# Altium project solinoid_driver.PrjPcb
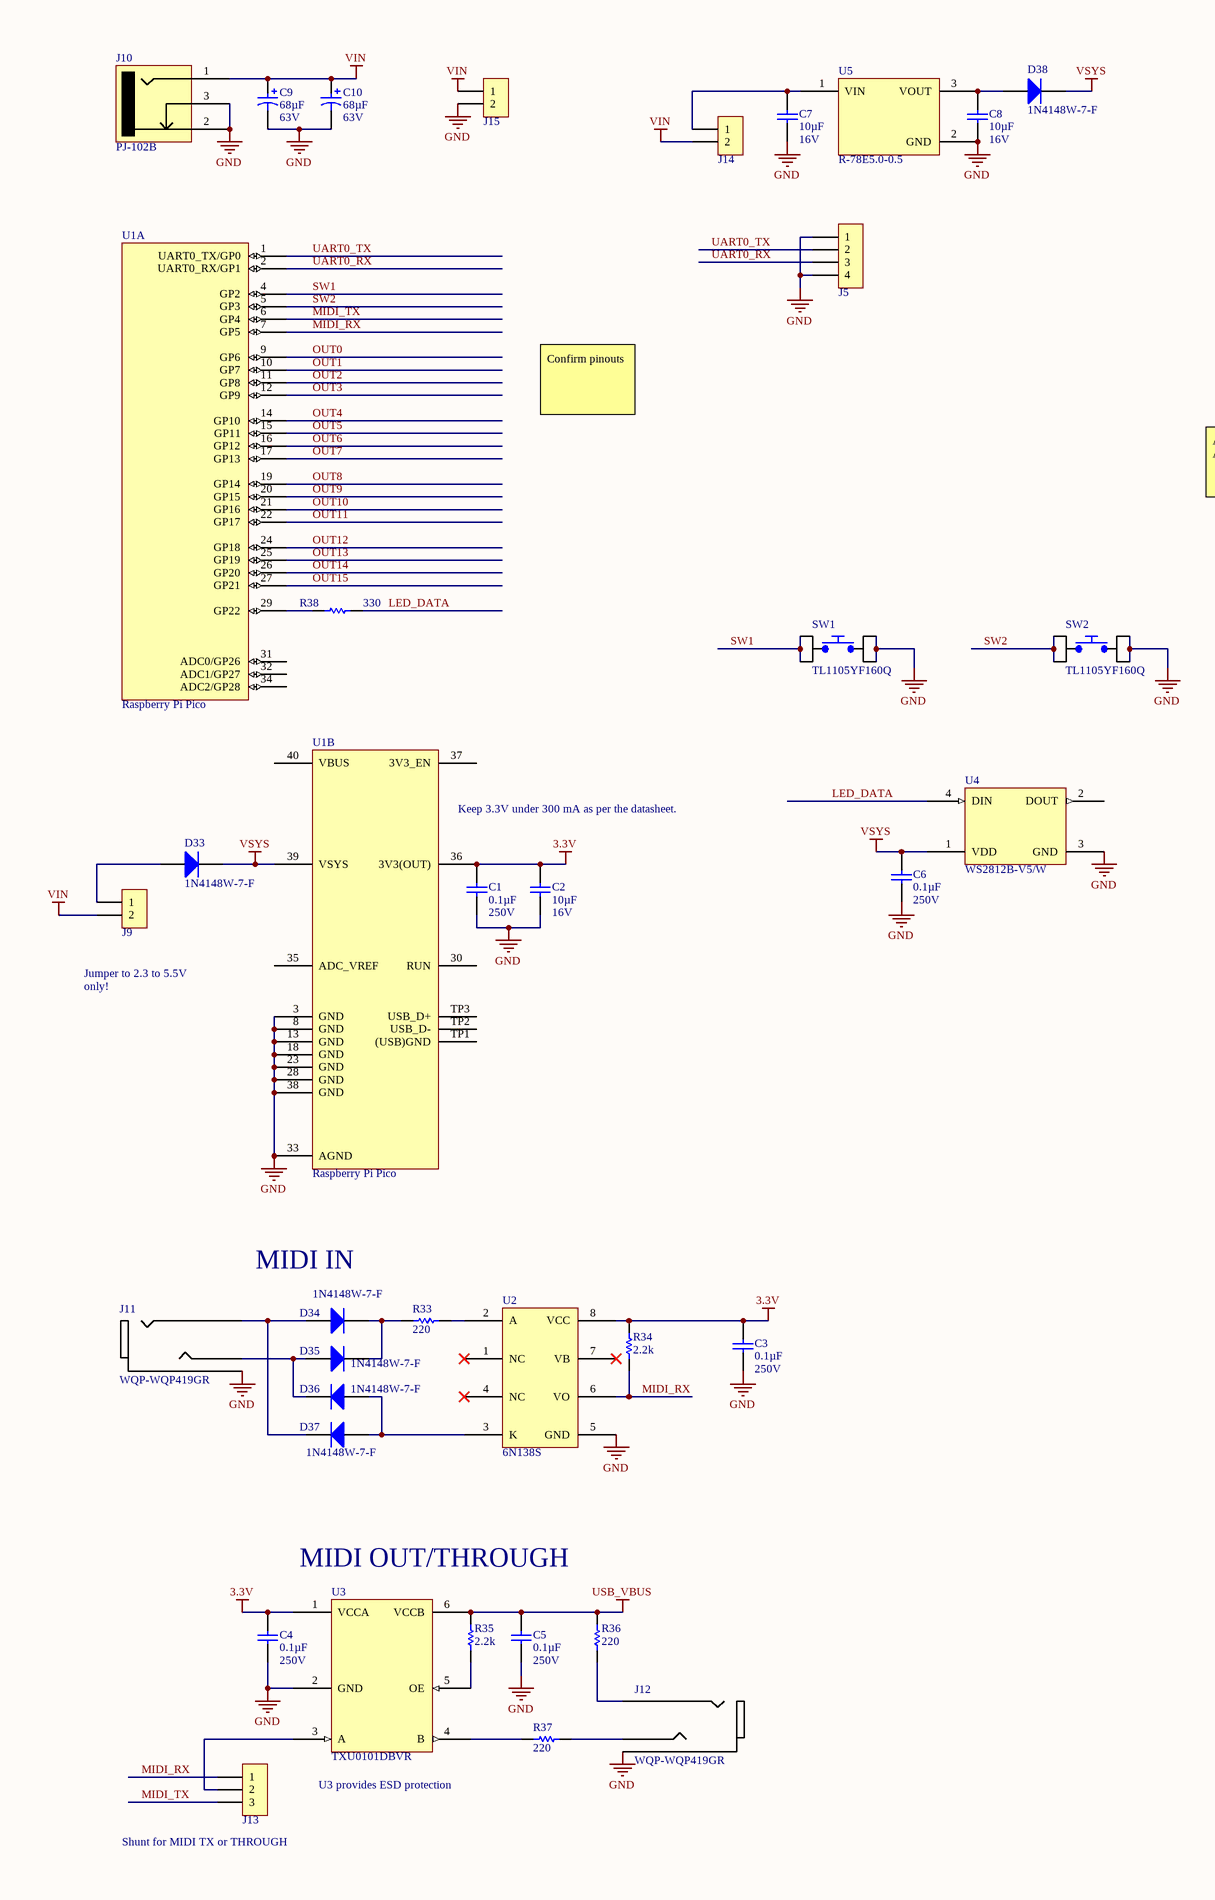
[diagram p0: solinoid_driver.SchDoc, left]
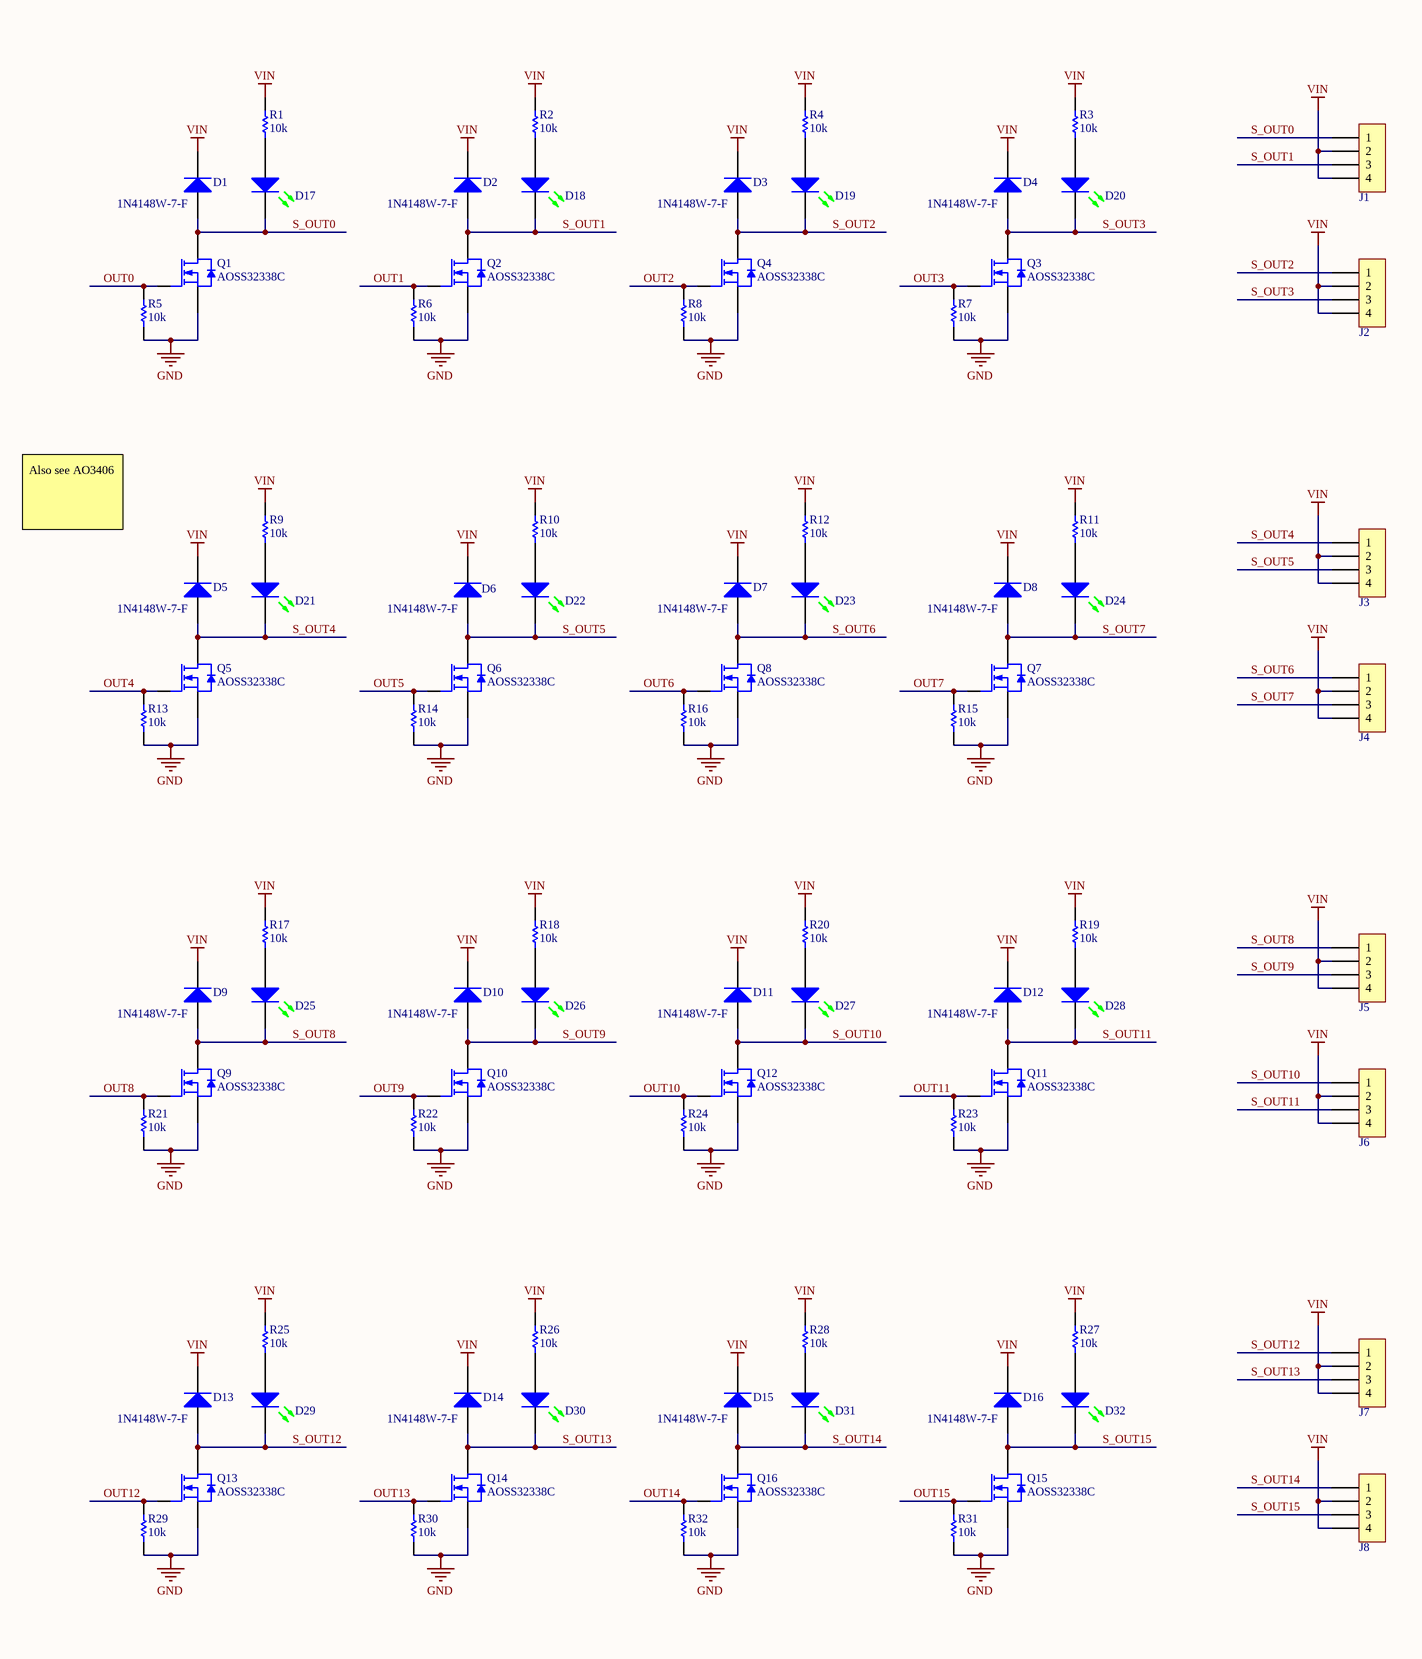
[diagram p1: solinoid_driver.SchDoc, right]
HardRev: A; LeadEngineer: JCF; Codename: solinoid_driver; BOMRev: A
1 sheet, 125 parts. Net scope: global (net labels, ports and power ports of the same name join across sheets).
Board file: solinoid_driver.PcbDoc

## Sheet solinoid_driver.SchDoc
size C; SheetNumber: 1; SheetTotal: 1

### Parts
(Parts that share a designator on the sheet are numbered #1, #2 ... from top to bottom, then left to right.)
C1  0.1µF  Voltage: 250V  [Chip0805]
C2  10µF  Voltage: 16V  [Chip0805]
C3  0.1µF  Voltage: 250V  [Chip0805]
C4  0.1µF  Voltage: 250V  [Chip0805]
C5  0.1µF  Voltage: 250V  [Chip0805]
C6  0.1µF  Voltage: 250V  [Chip0805]
C7  10µF  Voltage: 16V  [Chip0805]
C8  10µF  Voltage: 16V  [Chip0805]
C9  68µF  Voltage Rating: 63V  [CAP_CAN_TH_3p5mmLS8]
C10  68µF  Voltage Rating: 63V  [CAP_CAN_TH_3p5mmLS8]
D1  1N4148W-7-F  [SOD-123]
D2  1N4148W-7-F  [SOD-123]
D3  1N4148W-7-F  [SOD-123]
D4  1N4148W-7-F  [SOD-123]
D5  1N4148W-7-F  [SOD-123]
D6  1N4148W-7-F  [SOD-123]
D7  1N4148W-7-F  [SOD-123]
D8  1N4148W-7-F  [SOD-123]
D9  1N4148W-7-F  [SOD-123]
D10  1N4148W-7-F  [SOD-123]
D11  1N4148W-7-F  [SOD-123]
D12  1N4148W-7-F  [SOD-123]
D13  1N4148W-7-F  [SOD-123]
D14  1N4148W-7-F  [SOD-123]
D15  1N4148W-7-F  [SOD-123]
D16  1N4148W-7-F  [SOD-123]
D17  GREEN  [LED0603]  (value not drawn)
D18  GREEN  [LED0603]  (value not drawn)
D19  GREEN  [LED0603]  (value not drawn)
D20  GREEN  [LED0603]  (value not drawn)
D21  GREEN  [LED0603]  (value not drawn)
D22  GREEN  [LED0603]  (value not drawn)
D23  GREEN  [LED0603]  (value not drawn)
D24  GREEN  [LED0603]  (value not drawn)
D25  GREEN  [LED0603]  (value not drawn)
D26  GREEN  [LED0603]  (value not drawn)
D27  GREEN  [LED0603]  (value not drawn)
D28  GREEN  [LED0603]  (value not drawn)
D29  GREEN  [LED0603]  (value not drawn)
D30  GREEN  [LED0603]  (value not drawn)
D31  GREEN  [LED0603]  (value not drawn)
D32  GREEN  [LED0603]  (value not drawn)
D33  1N4148W-7-F  [SOD-123]
D34  1N4148W-7-F  [SOD-123]
D35  1N4148W-7-F  [SOD-123]
D36  1N4148W-7-F  [SOD-123]
D37  1N4148W-7-F  [SOD-123]
D38  1N4148W-7-F  [SOD-123]
J1  691210910004  [WURTH_691210910004]  (value not drawn)
J2  691210910004  [WURTH_691210910004]  (value not drawn)
J3  691210910004  [WURTH_691210910004]  (value not drawn)
J4  691210910004  [WURTH_691210910004]  (value not drawn)
J5#1  0533980471  [Molex_0533980471]  (value not drawn)
J5#2  691210910004  [WURTH_691210910004]  (value not drawn)
J6  691210910004  [WURTH_691210910004]  (value not drawn)
J7  691210910004  [WURTH_691210910004]  (value not drawn)
J8  691210910004  [WURTH_691210910004]  (value not drawn)
J9  3-644456-2  [TE_3-644456-2]  (value not drawn)
J10  PJ-102B  [CUI_PJ-102B]
J11  WQP-WQP419GR  [PJ366ST]
J12  WQP-WQP419GR  [PJ366ST]
J13  3-644456-3  [TE_3-644456-3]  (value not drawn)
J14  3-644456-2  [TE_3-644456-2]  (value not drawn)
J15  691210910002  [WURTH_691210910002]  (value not drawn)
Q1  AOSS32338C  [SOT23-3N]
Q2  AOSS32338C  [SOT23-3N]
Q3  AOSS32338C  [SOT23-3N]
Q4  AOSS32338C  [SOT23-3N]
Q5  AOSS32338C  [SOT23-3N]
Q6  AOSS32338C  [SOT23-3N]
Q7  AOSS32338C  [SOT23-3N]
Q8  AOSS32338C  [SOT23-3N]
Q9  AOSS32338C  [SOT23-3N]
Q10  AOSS32338C  [SOT23-3N]
Q11  AOSS32338C  [SOT23-3N]
Q12  AOSS32338C  [SOT23-3N]
Q13  AOSS32338C  [SOT23-3N]
Q14  AOSS32338C  [SOT23-3N]
Q15  AOSS32338C  [SOT23-3N]
Q16  AOSS32338C  [SOT23-3N]
R1  10k  [Chip0805]
R2  10k  [Chip0805]
R3  10k  [Chip0805]
R4  10k  [Chip0805]
R5  10k  [Chip0805]
R6  10k  [Chip0805]
R7  10k  [Chip0805]
R8  10k  [Chip0805]
R9  10k  [Chip0805]
R10  10k  [Chip0805]
R11  10k  [Chip0805]
R12  10k  [Chip0805]
R13  10k  [Chip0805]
R14  10k  [Chip0805]
R15  10k  [Chip0805]
R16  10k  [Chip0805]
R17  10k  [Chip0805]
R18  10k  [Chip0805]
R19  10k  [Chip0805]
R20  10k  [Chip0805]
R21  10k  [Chip0805]
R22  10k  [Chip0805]
R23  10k  [Chip0805]
R24  10k  [Chip0805]
R25  10k  [Chip0805]
R26  10k  [Chip0805]
R27  10k  [Chip0805]
R28  10k  [Chip0805]
R29  10k  [Chip0805]
R30  10k  [Chip0805]
R31  10k  [Chip0805]
R32  10k  [Chip0805]
R33  220  [Chip0805]
R34  2.2k  [Chip0805]
R35  2.2k  [Chip0805]
R36  220  [Chip0805]
R37  220  [Chip0805]
R38  330  [Chip0805]
SW1  TL1105YF160Q  [E-Switch_TL1105YF]
SW2  TL1105YF160Q  [E-Switch_TL1105YF]
U1  Raspberry Pi Pico  [RASPBERRY_PI_PICO]  (parts A,B of 2)
U2  6N138S  [6N13XS]
U3  TXU0101DBVR  [SOT-23-6N]
U4  WS2812B-V5/W  [WS2812B]
U5  R-78E5.0-0.5  [3-SIP_Module]

### Nets
3.3V: C1.2 C2.2 C3.2 C4.2 R34.2 U1.36(3V3(OUT)) U2.8(VCC) U3.1(VCCA)
GND: C1.1 C2.1 C3.1 C4.1 C5.1 C6.1 C7.1 C8.1 C9.2 C10.2 J5#1.1 J5#1.4 J10.2 J10.3 J11.1 J12.1 J15.2 Q1.2(S) Q2.2(S) Q3.2(S) Q4.2(S) Q5.2(S) Q6.2(S) Q7.2(S) Q8.2(S) Q9.2(S) Q10.2(S) Q11.2(S) Q12.2(S) Q13.2(S) Q14.2(S) Q15.2(S) Q16.2(S) R5.2 R6.2 R7.2 R8.2 R13.2 R14.2 R15.2 R16.2 R21.2 R22.2 R23.2 R24.2 R29.2 R30.2 R31.2 R32.2 SW1.3 SW1.4 SW2.3 SW2.4 U1.3(GND) U1.8(GND) U1.13(GND) U1.18(GND) U1.23(GND) U1.28(GND) U1.33(AGND) U1.38(GND) U2.5(GND) U3.2(GND) U4.3(GND) U5.2(GND)
USB_VBUS: C5.2 R35.2 R36.2 U3.6(VCCB)
VIN: C9.1 C10.1 D1.1(C) D2.1(C) D3.1(C) D4.1(C) D5.1(C) D6.1(C) D7.1(C) D8.1(C) D9.1(C) D10.1(C) D11.1(C) D12.1(C) D13.1(C) D14.1(C) D15.1(C) D16.1(C) J1.2 J1.4 J2.2 J2.4 J3.2 J3.4 J4.2 J4.4 J5#2.2 J5#2.4 J6.2 J6.4 J7.2 J7.4 J8.2 J8.4 J9.2 J10.1 J14.2 J15.1 R1.1 R2.1 R3.1 R4.1 R9.1 R10.1 R11.1 R12.1 R17.1 R18.1 R19.1 R20.1 R25.1 R26.1 R27.1 R28.1
VSYS: C6.2 D33.1(C) D38.1(C) U1.39(VSYS) U4.1(VDD)
LED_DATA: R38.2 U4.4(DIN)
MIDI_RX: J13.1 R34.1 U1.7(GP5) U2.6(VO)
MIDI_TX: J13.3 U1.6(GP4)
OUT0: Q1.1(G) R5.1 U1.9(GP6)
OUT1: Q2.1(G) R6.1 U1.10(GP7)
OUT2: Q4.1(G) R8.1 U1.11(GP8)
OUT3: Q3.1(G) R7.1 U1.12(GP9)
OUT4: Q5.1(G) R13.1 U1.14(GP10)
OUT5: Q6.1(G) R14.1 U1.15(GP11)
OUT6: Q8.1(G) R16.1 U1.16(GP12)
OUT7: Q7.1(G) R15.1 U1.17(GP13)
OUT8: Q9.1(G) R21.1 U1.19(GP14)
OUT9: Q10.1(G) R22.1 U1.20(GP15)
OUT10: Q12.1(G) R24.1 U1.21(GP16)
OUT11: Q11.1(G) R23.1 U1.22(GP17)
OUT12: Q13.1(G) R29.1 U1.24(GP18)
OUT13: Q14.1(G) R30.1 U1.25(GP19)
OUT14: Q16.1(G) R32.1 U1.26(GP20)
OUT15: Q15.1(G) R31.1 U1.27(GP21)
S_OUT0: D1.2(A) D17.2(C) J1.1 Q1.3(D)
S_OUT1: D2.2(A) D18.2(C) J1.3 Q2.3(D)
S_OUT2: D3.2(A) D19.2(C) J2.1 Q4.3(D)
S_OUT3: D4.2(A) D20.2(C) J2.3 Q3.3(D)
S_OUT4: D5.2(A) D21.2(C) J3.1 Q5.3(D)
S_OUT5: D6.2(A) D22.2(C) J3.3 Q6.3(D)
S_OUT6: D7.2(A) D23.2(C) J4.1 Q8.3(D)
S_OUT7: D8.2(A) D24.2(C) J4.3 Q7.3(D)
S_OUT8: D9.2(A) D25.2(C) J5#2.1 Q9.3(D)
S_OUT9: D10.2(A) D26.2(C) J5#2.3 Q10.3(D)
S_OUT10: D11.2(A) D27.2(C) J6.1 Q12.3(D)
S_OUT11: D12.2(A) D28.2(C) J6.3 Q11.3(D)
S_OUT12: D13.2(A) D29.2(C) J7.1 Q13.3(D)
S_OUT13: D14.2(A) D30.2(C) J7.3 Q14.3(D)
S_OUT14: D15.2(A) D31.2(C) J8.1 Q16.3(D)
S_OUT15: D16.2(A) D32.2(C) J8.3 Q15.3(D)
SW1: SW1.1 SW1.2 U1.4(GP2)
SW2: SW2.1 SW2.2 U1.5(GP3)
UART0_RX: J5#1.3 U1.2(UART0_RX/GP1)
UART0_TX: J5#1.2 U1.1(UART0_TX/GP0)
NetC7_2: C7.2 J14.1 U5.1(VIN)
NetC8_2: C8.2 D38.2(A) U5.3(VOUT)
NetD17_1: D17.1(A) R1.2
NetD18_1: D18.1(A) R2.2
NetD19_1: D19.1(A) R4.2
NetD20_1: D20.1(A) R3.2
NetD21_1: D21.1(A) R9.2
NetD22_1: D22.1(A) R10.2
NetD23_1: D23.1(A) R12.2
NetD24_1: D24.1(A) R11.2
NetD25_1: D25.1(A) R17.2
NetD26_1: D26.1(A) R18.2
NetD27_1: D27.1(A) R20.2
NetD28_1: D28.1(A) R19.2
NetD29_1: D29.1(A) R25.2
NetD30_1: D30.1(A) R26.2
NetD31_1: D31.1(A) R28.2
NetD32_1: D32.1(A) R27.2
NetD33_2: D33.2(A) J9.1
NetD34_1: D34.1(C) D35.1(C) R33.1
NetD34_2: D34.2(A) D37.1(C) J11.2
NetD35_2: D35.2(A) D36.1(C) J11.3
NetD36_2: D36.2(A) D37.2(A) U2.3(K)
NetJ12_2: J12.2 R36.1
NetJ12_3: J12.3 R37.2
NetJ13_2: J13.2 U3.3(A)
NetR33_2: R33.2 U2.2(A)
NetR35_1: R35.1 U3.5(OE)
NetR37_1: R37.1 U3.4(B)
NetR38_1: R38.1 U1.29(GP22)

Not connected (* = marked no-connect by the designer): U1 30(RUN) 31(ADC0/GP26) 32(ADC1/GP27) 34(ADC2/GP28) 35(ADC_VREF) 37(3V3_EN) 40(VBUS) TP1((USB)GND) TP2(USB_D-) TP3(USB_D+); U2 1(NC)* 4(NC)* 7(VB)*; U4 2(DOUT)

### Notes on the sheet
- Confirm pinouts
- Also see AO3406
- (near U1) Keep 3.3V under 300 mA as per the datasheet.
- Jumper to 2.3 to 5.5V only!
- MIDI IN
- MIDI OUT/THROUGH
- U3 provides ESD protection
- (near J13) Shunt for MIDI TX or THROUGH
- Title:
- This work is licensed under a Creative Commons Attribution 4.0 International License. Derivative works should remove all Sophistry branding and ‘é’ watermark.
- Date:
- Engineer:
- Revision:
- Codename:
- Time:
- Variant:
- Sheet
- of

### Library data of the parts
C1 C3-C6 = C2012X7T2E104K125AA: CAP CER 0.1UF 250V 10% X7T 0805; Manufacturer: TDK Corporation; PartNumber: C2012X7T2E104K125AA; HelpURL: http://product.tdk.com/capacitor/mlcc/en/documents/mlcc_commercial_midvoltage_en.pdf; Supplier 1: Digi-Key; Supplier Part Number 1: 445-7749-1-ND; Supplier 2: Mouser; Manufacturer Part Number: C2012X7T2E104K125AA; Series: C; Capacitance: 0.1µF; Tolerance: ±10%; Temperature Coefficient: X7T; Mounting Type: Surface Mount, MLCC; Operating Temperature: -55°C ~ 125°C; Applications: General Purpose; Ratings: -; Package / Case: 0805 (2012 Metric); Size / Dimension: 0.079" L x 0.049" W (2.00mm x 1.25mm); Height - Seated (Max): -; Thickness (Max): 0.057" (1.45mm); Lead Spacing: -; Features: -; Lead Style: -
C2 C7 C8 = C2012X5R1C106K125AC: CAP CER 10UF 16V 10% X5R 0805; Manufacturer: TDK Corporation; PartNumber: C2012X5R1C106K125AC; HelpURL: http://product.tdk.com/capacitor/mlcc/en/documents/mlcc_commercial_general_en.pdf; Supplier 1: Digi-Key; Supplier Part Number 1: 445-7646-1-ND; Supplier 2: Mouser; Manufacturer Part Number: C2012X5R1C106K125AC; Series: C; Capacitance: 10µF; Tolerance: ±10%; Temperature Coefficient: X5R; Mounting Type: Surface Mount, MLCC; Operating Temperature: -55°C ~ 85°C; Applications: General Purpose; Ratings: -; Package / Case: 0805 (2012 Metric); Size / Dimension: 0.079" L x 0.049" W (2.00mm x 1.25mm); Height - Seated (Max): -; Thickness (Max): 0.057" (1.45mm); Lead Spacing: -; Features: -; Lead Style: -
C9 C10 = UPW1J680MPD: CAP ALUM 68UF 20% 63V RADIAL; Manufacturer: Nichicon; Unit Price (USD): 0.48; Lifetime @ Temp#: 3000 Hrs @ 105°C; Type: Polar; Ripple Current: 263.2mA; Impedance: 342 mOhm; PartNumber: UPW1J680MPD; Supplier 1: Digi-Key; Supplier 2: Mouser; HelpURL: http://nichicon-us.com/english/products/pdfs/e-pw.pdf; Supplier Part Number 1: 493-1935-ND; Manufacturer Part Number: UPW1J680MPD; Series: PW; Capacitance: 68µF; Tolerance: ±20%; ESR (Equivalent Series Resistance): -; Operating Temperature: -55°C ~ 105°C; Applications: General Purpose; Lead Spacing: 0.138" (3.50mm); Size / Dimension: 0.315" Dia (8.00mm); Height - Seated (Max): 0.453" (11.50mm); Surface Mount Land Size: -; Mounting Type: Through Hole; Package / Case: Radial, Can
D1-D16 D33-D38 = 1N4148W-7-F: DIODE SWITCH 100V 0.15A SOD123; Manufacturer: Diodes Incorporated; Diode Type: Standard; Current - Average Rectified (Io): 150mA; Voltage - Forward (Vf) (Max) @ If: 1.25V @ 150mA; Speed: Small Signal =< 200mA (Io), Any Speed; Reverse Recovery Time (trr): 4ns; Current - Reverse Leakage @ Vr: 1µA @ 75V; Capacitance @ Vr, F: 2pF @ 0V, 1MHz; PartNumber: 1N4148W-7-F; Datasheets: http://www.diodes.com/datasheets/ds30086.pdf; Supplier 1: Digi-Key; Supplier Part Number 1: 1N4148W-FDICT-ND; Manufacturer Part Number: 1N4148W-7-F; Series: 0; Voltage - DC Reverse (Vr) (Max): 100V; Mounting Type: Surface Mount; Package / Case: SOD-123; Supplier Device Package: SOD-123; Operating Temperature - Junction: -65°C ~ 150°C
D17-D32 = LTST-C191GKT: LED GREEN CLEAR THIN 0603 SMD; Manufacturer: Lite-On Inc; PartNumber: LTST-C191GKT; Datasheets: http://optoelectronics.liteon.com/upload/download/DS22-2000-300/S_110_LTST-C191TGKT.pdf; Supplier 1: Digi-Key; Supplier Part Number 1: 160-1443-1-ND; Supplier 2: Mouser; Supplier Part Number 2: 859-LTST-C191GKT; Manufacturer Part Number: LTST-C191GKT; Color: Green
J1-J4 J5#2 J6-J8 = 691210910004: TERM BLOCK 4P HORIZON 2.54MM PCB; Manufacturer: Würth Elektronik; PartNumber: 691210910004; Supplier 1: Digi-Key; Supplier 2: Mouser; Supplier 3: LCSC; Supplier Part Number 1: 732-691210910004-ND; Supplier Part Number 2: 710-691210910004; HelpURL: https://www.we-online.com/catalog/datasheet/691210910004.pdf; Manufacturer Part Number: 691210910004
J5#1 = 0533980471: CONN HEADER SMD 4POS 1.25MM; Manufacturer: Molex; PartNumber: 0533980471; Supplier 1: Digi-Key; Supplier 2: Mouser; Supplier 21: LCSC; Supplier Part Number 1: WM7608CT-ND; Supplier Part Number 2: 538-53398-0471; Supplier Part Number 3: C234195; HelpURL: https://www.molex.com/pdm_docs/sd/533980471_sd.pdf; Manufacturer Part Number: 0533980471
J9 J14 = 3-644456-2: CONN HEADER VERT 2POS .100 TIN; Manufacturer: TE Connectivity; PartNumber: 3-644456-2; Supplier 1: Digi-Key; Supplier 2: Mouser; Supplier Part Number 1: A31112-ND; Supplier Part Number 2: 571-3-644456-2; HelpURL: http://www.te.com/commerce/DocumentDelivery/DDEController?Action=srchrtrv&DocNm=644456&DocType=Customer+Drawing&DocLang=English; Manufacturer Part Number: 3-644456-2
J10 = PJ-102B: CONN PWR JACK 2.5X5.5MM SOLDER; Manufacturer: CUI Devices; PartNumber: PJ-102B; HelpURL: https://www.cuidevices.com/product/resource/pj-102b.pdf; Supplier 1: Digi-Key; Supplier Part Number 1: CP-102B-ND; Supplier 2: Mouser; Supplier Part Number 2: 490-PJ-102B; Manufacturer Part Number: PJ-102B
J11 J12 = WQP-WQP419GR: CONN 3.5mm VIRTICAL STEREO; Manufacturer: QingPu; Connector Type: Phone Jack; Gender: Female; PartNumber: WQP-WQP419GR; HelpURL: http://www.qingpu-electronics.com/en/products/WQP-PJ366ST-364.html; Supplier 1: QingPu; Supplier Part Number 1: WQP-WQP419GR; Manufacturer Part Number: WQP-WQP419GR; Signal Lines: Stereo
J13 = 3-644456-3: CONN HEADER VERT 3POS .100 TIN; Manufacturer: TE Connectivity; PartNumber: 3-644456-3; Supplier 1: Digi-Key; Supplier 2: Mouser; Supplier Part Number 1: A31113-ND; Supplier Part Number 2: 571-3-644456-3; HelpURL: http://www.te.com/commerce/DocumentDelivery/DDEController?Action=srchrtrv&DocNm=644456&DocType=Customer+Drawing&DocLang=English; Manufacturer Part Number: 3-644456-3
J15 = 691210910002: TERM BLOCK 2P HORIZON 2.54MM PCB; Manufacturer: Würth Elektronik; PartNumber: 691210910002; Supplier 1: Digi-Key; Supplier 2: Mouser; Supplier 3: LCSC; Supplier Part Number 1: 732-691210910002-ND; Supplier Part Number 2: 710-691210910002; HelpURL: https://www.we-online.com/catalog/datasheet/691210910002.pdf; Manufacturer Part Number: 691210910002
Q1-Q16 = AOSS32338C: MOSFET N-CH 30V 4A SOT23-3; Manufacturer: Alpha & Omega Semiconductor Inc.; PartNumber: AOSS32338C; Supplier 1: Digi-Key; Supplier 2: Mouser; Supplier 3: LCSC; Supplier Part Number 1: 785-AOSS32338CTR-ND; Supplier Part Number 3: C5587797; HelpURL: https://aosmd.com/res/data_sheets/AOSS32338C.pdf; Manufacturer Part Number: AOSS32338C
R1-R32 = CRCW080510K0FKEA: RES 10.0K OHM 1/8W 1% 0805 SMD; Manufacturer: Vishay Dale; Power (Watts): 0.125W, 1/8W; Temperature Coefficient: ±100ppm/°C; PartNumber: CRCW080510K0FKEA; HelpURL: http://www.vishay.com/doc?20035; Supplier 1: Digi-Key; Supplier Part Number 1: 541-10.0KCCT-ND; Supplier 2: Mouser; Manufacturer Part Number: CRCW080510K0FKEA; Series: CRCW; Resistance: 10k; Tolerance: ±1%; Composition: Thick Film; Features: Automotive AEC-Q200 Qualified; Package / Case: 0805 (2012 Metric); Supplier Device Package: 0805 (2012 Metric); Size / Dimension: 0.079" L x 0.049" W (2.00mm x 1.25mm); Height: 0.020" (0.50mm); Number of Terminations: 2
R33 R36 R37 = CRCW0805220RFKEA: RES 220 OHM 1/8W 1% 0805 SMD; Manufacturer: Vishay Dale; Power (Watts): 0.125W, 1/8W; Temperature Coefficient: ±100ppm/°C; PartNumber: CRCW0805220RFKEA; HelpURL: http://www.vishay.com/doc?20035; Supplier 1: Digi-Key; Supplier Part Number 1: 541-220CCT-ND; Supplier 2: Mouser; Manufacturer Part Number: CRCW0805220RFKEA; Series: CRCW; Resistance: 220; Tolerance: ±1%; Composition: Thick Film; Features: Automotive AEC-Q200 Qualified; Package / Case: 0805 (2012 Metric); Supplier Device Package: 0805 (2012 Metric); Size / Dimension: 0.079" L x 0.049" W (2.00mm x 1.25mm); Height: 0.020" (0.50mm); Number of Terminations: 2
R34 R35 = CRCW08052K20FKEA: RES 2.20K OHM 1/8W 1% 0805 SMD; Manufacturer: Vishay Dale; Power (Watts): 0.125W, 1/8W; Temperature Coefficient: ±100ppm/°C; PartNumber: CRCW08052K20FKEA; HelpURL: http://www.vishay.com/doc?20035; Supplier 1: Digi-Key; Supplier Part Number 1: 541-2.20KCCT-ND; Supplier 2: Mouser; Manufacturer Part Number: CRCW08052K20FKEA; Series: CRCW; Resistance: 2.2k; Tolerance: ±1%; Composition: Thick Film; Features: Automotive AEC-Q200 Qualified; Package / Case: 0805 (2012 Metric); Supplier Device Package: 0805 (2012 Metric); Size / Dimension: 0.079" L x 0.049" W (2.00mm x 1.25mm); Height: 0.020" (0.50mm); Number of Terminations: 2
R38 = CRCW0805330RFKEA: RES 330 OHM 1/8W 1% 0805 SMD; Manufacturer: Vishay Dale; Power (Watts): 0.125W, 1/8W; Temperature Coefficient: ±100ppm/°C; PartNumber: CRCW0805330RFKEA; HelpURL: http://www.vishay.com/doc?20035; Supplier 1: Digi-Key; Supplier Part Number 1: 541-330CCT-ND; Supplier 2: Mouser; Manufacturer Part Number: CRCW0805330RFKEA; Series: CRCW; Resistance: 330; Tolerance: ±1%; Composition: Thick Film; Features: Automotive AEC-Q200 Qualified; Package / Case: 0805 (2012 Metric); Supplier Device Package: 0805 (2012 Metric); Size / Dimension: 0.079" L x 0.049" W (2.00mm x 1.25mm); Height: 0.020" (0.50mm); Number of Terminations: 2
SW1 SW2 = TL1105YF160Q: SWITCH TACTILE SPST-NO 0.05A 12V; Manufacturer: E-Switch; PartNumber: TL1105YF160Q; HelpURL: https://configured-product-images.s3.amazonaws.com/Datasheets/TL1105.pdf; Supplier 1: Digi-Key; Supplier 2: Mouser; Supplier 3: LCSC; Supplier Part Number 1: EG5455-ND; Supplier Part Number 2: 612-TL1105YF160Q; Supplier Part Number 3: C4364602; Manufacturer Part Number: TL1105YF160Q
U1 = Raspberry Pi Pico: RASPBERRY PI PICO RP2040 BOARD; Manufacturer Part Number: SC0915; PartNumber: Raspberry Pi Pico; Supplier 1: Digi-Key; Supplier Part Number 1: 2648-SC0915CT-ND; Manufacturer: Raspberry Pi
U2 = 6N138S: OPTOISO 5KV DARL W/BASE 8SMD; Manufacturer: Lite-On Inc.; PartNumber: 6N138S; Supplier 1: Digi-Key; Supplier 2: Mouser; Supplier Part Number 2: 859-6N138S; HelpURL: https://media.digikey.com/pdf/Data%20Sheets/Lite-On%20PDFs/6N138-39%20Series.pdf; Supplier Part Number 1: 160-1797-ND; Manufacturer Part Number: 6N138S
U3 = TXU0101DBVR: IC XLTR VL UNIDIR SOT-23-6; Manufacturer: Texas Instruments; PartNumber: TXU0101DBVR; Supplier 1: Digi-Key; Supplier 2: Mouser; Supplier 3: LCSC; Supplier Part Number 1: 296-TXU0101DBVRCT-ND; Supplier Part Number 2: 595-TXU0101DBVR; Supplier Part Number 3: C7136368; HelpURL: https://www.ti.com/lit/ds/symlink/txu0101.pdf; Manufacturer Part Number: TXU0101DBVR
U4 = WS2812B-V5/W: Addressable RGB LED; Manufacturer: Worldsemi; PartNumber: WS2812B-V5/W; Datasheets: https://www.peace-corp.co.jp/data/WS2812B-V5_V1.0_EN.pdf; Supplier 1: Digi-Key; Supplier Part Number 1: 1568-COM-16347CT-ND; Supplier 2: Mouser; Supplier Part Number 2: 474-COM-24837; Supplier 3: LCSC; Supplier Part Number 3: C2874885; Manufacturer Part Number: WS2812B-V5/W
U5 = R-78E5.0-0.5: DC DC CONVERTER 5V 3W; Manufacturer: Recom Power; PartNumber: R-78E5.0-0.5; HelpURL: https://recom-power.com/pdf/Innoline/R-78E-0.5.pdf; Supplier 1: Digi-Key; Supplier Part Number 1: 945-1648-5-ND; Supplier 2: Mouser; Supplier Part Number 2: 919-R-78E5.0-0.5; Supplier 3: LCSC; Supplier Part Number 21: C5199916; Manufacturer Part Number: R-78E5.0-0.5